# Altium schematic sheet USB.SchDoc
size A4; SheetNumber: 9; SheetTotal: 14
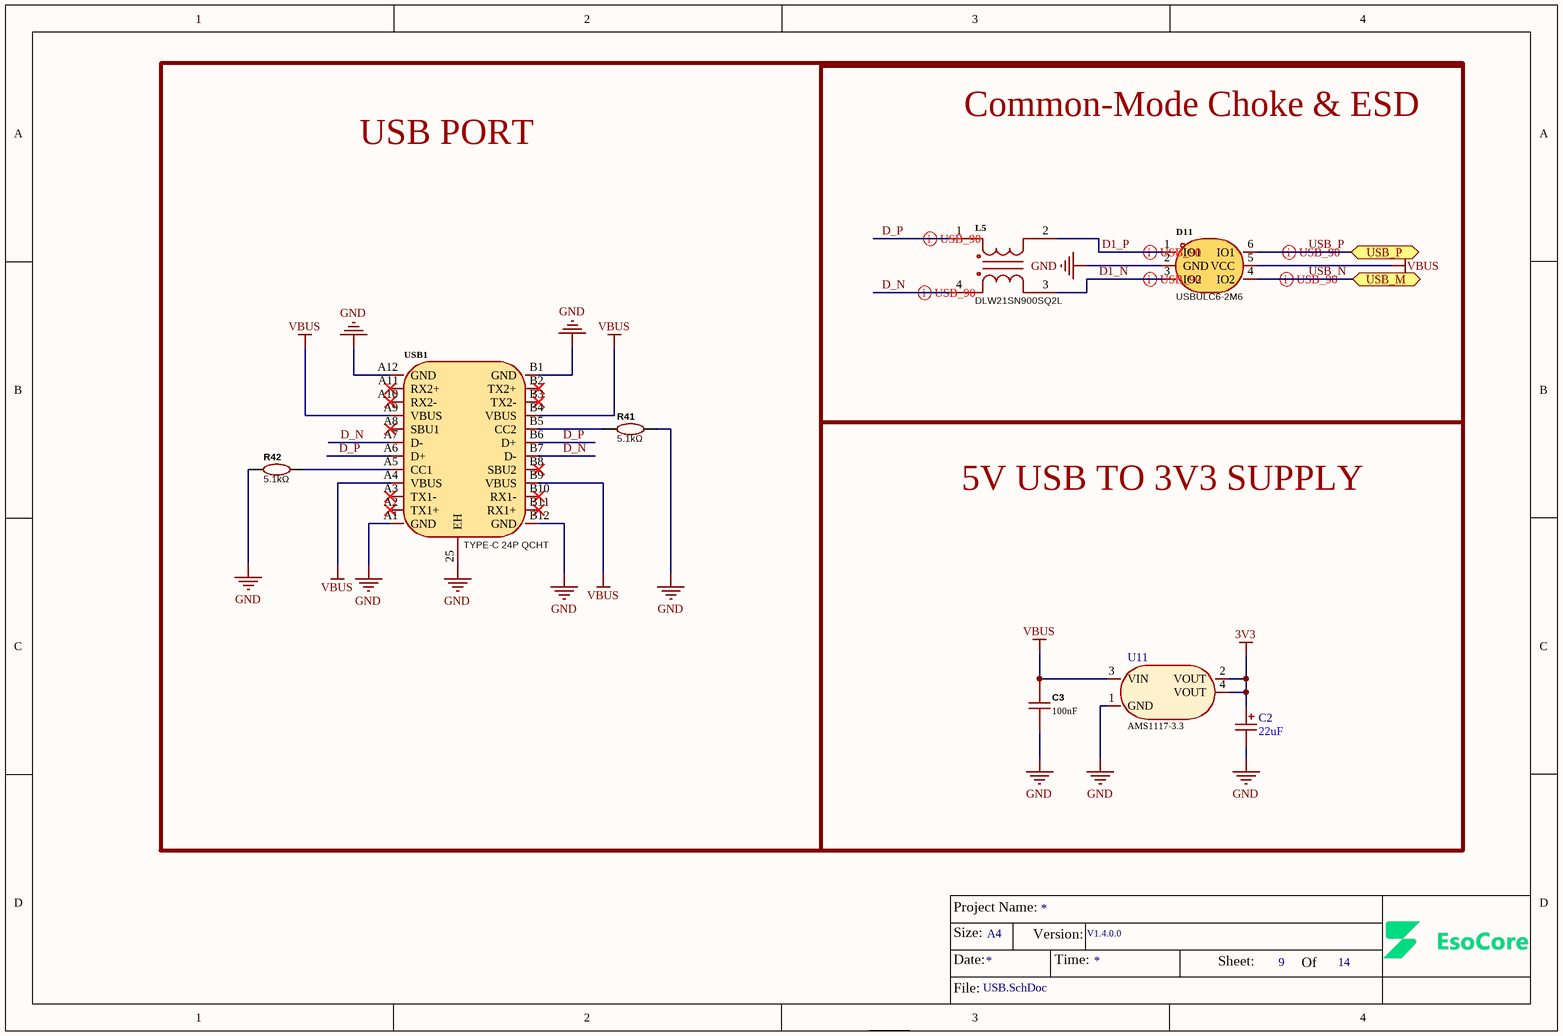
[diagram p0: USB.SchDoc]

## Parts
C2  22uF  [CASE-A_3216]
C3  100nF  [C_0603]
D11  USBULC6-2M6  [SON-6_L1.4-W1.0-P0.50-TL_USBULC6-2M6]
L5  DLW21SN900SQ2L  [FILTER-SMD_4P-L2.0-W1.2-BL_DLW21H]
R41  5.1kΩ  [R_0603]
R42  5.1kΩ  [R_0603]
U11  AMS1117-3.3  [SOT-223-3_L6.5-W3.4-P2.30-LS7.0-BR]
USB1  TYPE-C 24P QCHT  [TYPE-C-SMD_TYPE-C-24P-QCHT]

## Blocks framed on the sheet
USB PORT: R41 R42 USB1
Common-Mode Choke & ESD: D11 L5
5V USB TO 3V3 SUPPLY: C2 C3 U11

## Ports
USB_M (bidir), USB_P (bidir)

## Nets
3V3: C2.1 U11.2(VOUT) U11.4(VOUT)
GND: C2.2 C3.2 D11.2(GND) R41.2 R42.1 U11.1(GND) USB1.25(EH) USB1.A1(GND) USB1.A12(GND) USB1.B1(GND) USB1.B12(GND)
VBUS: C3.1 D11.5(VCC) U11.3(VIN) USB1.A4(VBUS) USB1.A9(VBUS) USB1.B4(VBUS) USB1.B9(VBUS)
D1_N: D11.3(IO2) L5.3
D1_P: D11.1(IO1) L5.2
D_N: L5.4 USB1.A7(D-) USB1.B7(D-)
D_P: L5.1 USB1.A6(D+) USB1.B6(D+)
USB_N: D11.4(IO2) ; port USB_M
USB_P: D11.6(IO1) ; port USB_P
NetR41_1: R41.1 USB1.B5(CC2)
NetR42_2: R42.2 USB1.A5(CC1)

Not connected (* = marked no-connect by the designer): USB1 A2(TX1+)* A3(TX1-)* A8(SBU1)* A10(RX2-)* A11(RX2+)* B2(TX2+)* B3(TX2-)* B8(SBU2)* B10(RX1-)* B11(RX1+)*

## Layout directives
differential pair; differential pair class USB_90: D1_N, D1_P, D_N, D_P, USB_N, USB_P

## Notes on the sheet
- Project Name:
- Size:
- Date:
- A4
- Version:
- Time:
- V1.4.0.0
- Sheet:
- Of
- File:

## Library data of the parts
C2 = TAJA226K010RNJ: Manufacturer: Kyocera AVX; Add into BOM: yes; Tolerance: ±10%; Voltage Rating: 10V; Equivalent Series Resistance(ESR): 3Ω@100kHz; Symbol: TAJA226K010RNJ; Device: TAJA226K010RNJ; LCSC Part Name: 22uF ±10% 10V; Supplier Part: C11366; Manufacturer Part: TAJA226K010RNJ; Supplier Footprint: CASE-A-3216-18(mm); JLCPCB Part Class: Extended Part; Supplier: LCSC; Convert to PCB: yes; Value: 22uF; Operating Temperature: -55℃~+125℃
C3 = CC0603KRX7R9BB104: Manufacturer: YAGEO(国巨); Add into BOM: yes; Tolerance: ±10%; Voltage Rating: 50V; Temperature Coefficient: X7R; Symbol: CC0603KRX7R9BB104; Device: CC0603KRX7R9BB104; LCSC Part Name: 100nF ±10% 50V; Supplier Part: C14663; Manufacturer Part: CC0603KRX7R9BB104; Supplier Footprint: 0603; JLCPCB Part Class: Basic Part; Datasheet: https://item.szlcsc.com/datasheet/CC0603KRX7R9BB104/15331.html; Supplier: LCSC; Convert to PCB: yes; Value: 100nF
D11 = USBULC6-2M6: Manufacturer: ST(意法半导体); Add into BOM: yes; Clamping Voltage: 17V; Voltage - Breakdown: 6V; Reverse Leakage Current (Ir): 500nA; Number of Channels: 2; level of protection: IEC 61000-4-2; Type: ESD; Junction Capacitance: 0.65pF; Symbol: USBULC6-2M6; Device: USBULC6-2M6; LCSC Part Name: USBULC6-2M6; Supplier Part: C672213; Manufacturer Part: USBULC6-2M6; Supplier Footprint: UQFN-6; JLCPCB Part Class: Extended Part; Datasheet: https://item.szlcsc.com/datasheet/USBULC6-2M6/703258.html; Supplier: LCSC; Convert to PCB: yes
L5 = DLW21SN900SQ2L: Manufacturer: muRata(村田); Add into BOM: yes; Number of Lines: 2; Current Rating: 330mA; Impedance @ Frequency: 90Ω@100MHz; Symbol: DLW21SN900SQ2L; Device: DLW21SN900SQ2L; LCSC Part Name: 两路 贴片共模滤波器 阻抗90Ω@100MHz; Supplier Part: C97856; Manufacturer Part: DLW21SN900SQ2L; Supplier Footprint: SMD-4P,2x1.2mm; JLCPCB Part Class: Extended Part; Datasheet: https://item.szlcsc.com/datasheet/DLW21SN900SQ2L/99065.html; Supplier: LCSC; Convert to PCB: yes; Voltage Rating - DC: -; DC Resistance(DCR): -; Operating Temperature: -40℃~+85℃
R41 R42 = 5.1kΩ: Manufacturer: YAGEO(国巨); Manufacturer Part: RC0603FR-075K1L; nameAlias: Value; Supplier: LCSC; Supplier Part: C105580; JLCPCB Part Class: Extended Part; spicePre: R; spiceSymbolName: RC0603FR-075K1L
U11 = AMS1117-3.3_C6186: Manufacturer: AMS; Add into BOM: yes; Output Type: Fixed; Voltage - Supply: 16V; Output Voltage: 3.3V; Output Current: 1A; Power Supply Rejection Ratio (PSRR): 72dB@(120Hz); Voltage Dropout: 1.1V@(800mA); standby current: 5mA; Output Configuration: Positive; Number of Outputs: 1; Symbol: AMS1117-3.3; Device: AMS1117-3.3_C6186; LCSC Part Name: 输出3.3V 1A; Supplier Part: C6186; Manufacturer Part: AMS1117-3.3; Supplier Footprint: SOT-223; JLCPCB Part Class: Basic Part; Datasheet: https://item.szlcsc.com/datasheet/AMS1117-3.3/6652.html; Supplier: LCSC; Convert to PCB: yes; Noise: -; Features: Over Current Protection；Over Temperature Protection; Operating Temperature: -40℃~+125℃
USB1 = TYPE-C 24P QCHT: Manufacturer: SHOU HAN(首韩); Add into BOM: yes; Protocol Standard: USB 3.1; Gender: Female; Number of Ports: 1; Current Rating-Power: 3A; Voltage Rating: 30V; Connect-Disconnect Life: 10,000 Cycles; Detection color: Black; Symbol: TYPE-C 24P QCHT; Device: TYPE-C 24P QCHT; LCSC Part Name: Type-C 母 卧贴; Supplier Part: C456013; Manufacturer Part: TYPE-C 24P QCHT; Supplier Footprint: SMD; JLCPCB Part Class: Extended Part; Datasheet: https://item.szlcsc.com/datasheet/TYPE-C%252024P%2520QCHT/458820.html; Supplier: LCSC; Convert to PCB: yes; Connector Type: Type-C; Mounting Type: Surface Mount, Right Angle; Number of Contacts: 24P; Operating Temperature: -40℃~+85℃